# EAGLE design gyro_idg (EAGLE 6.1)
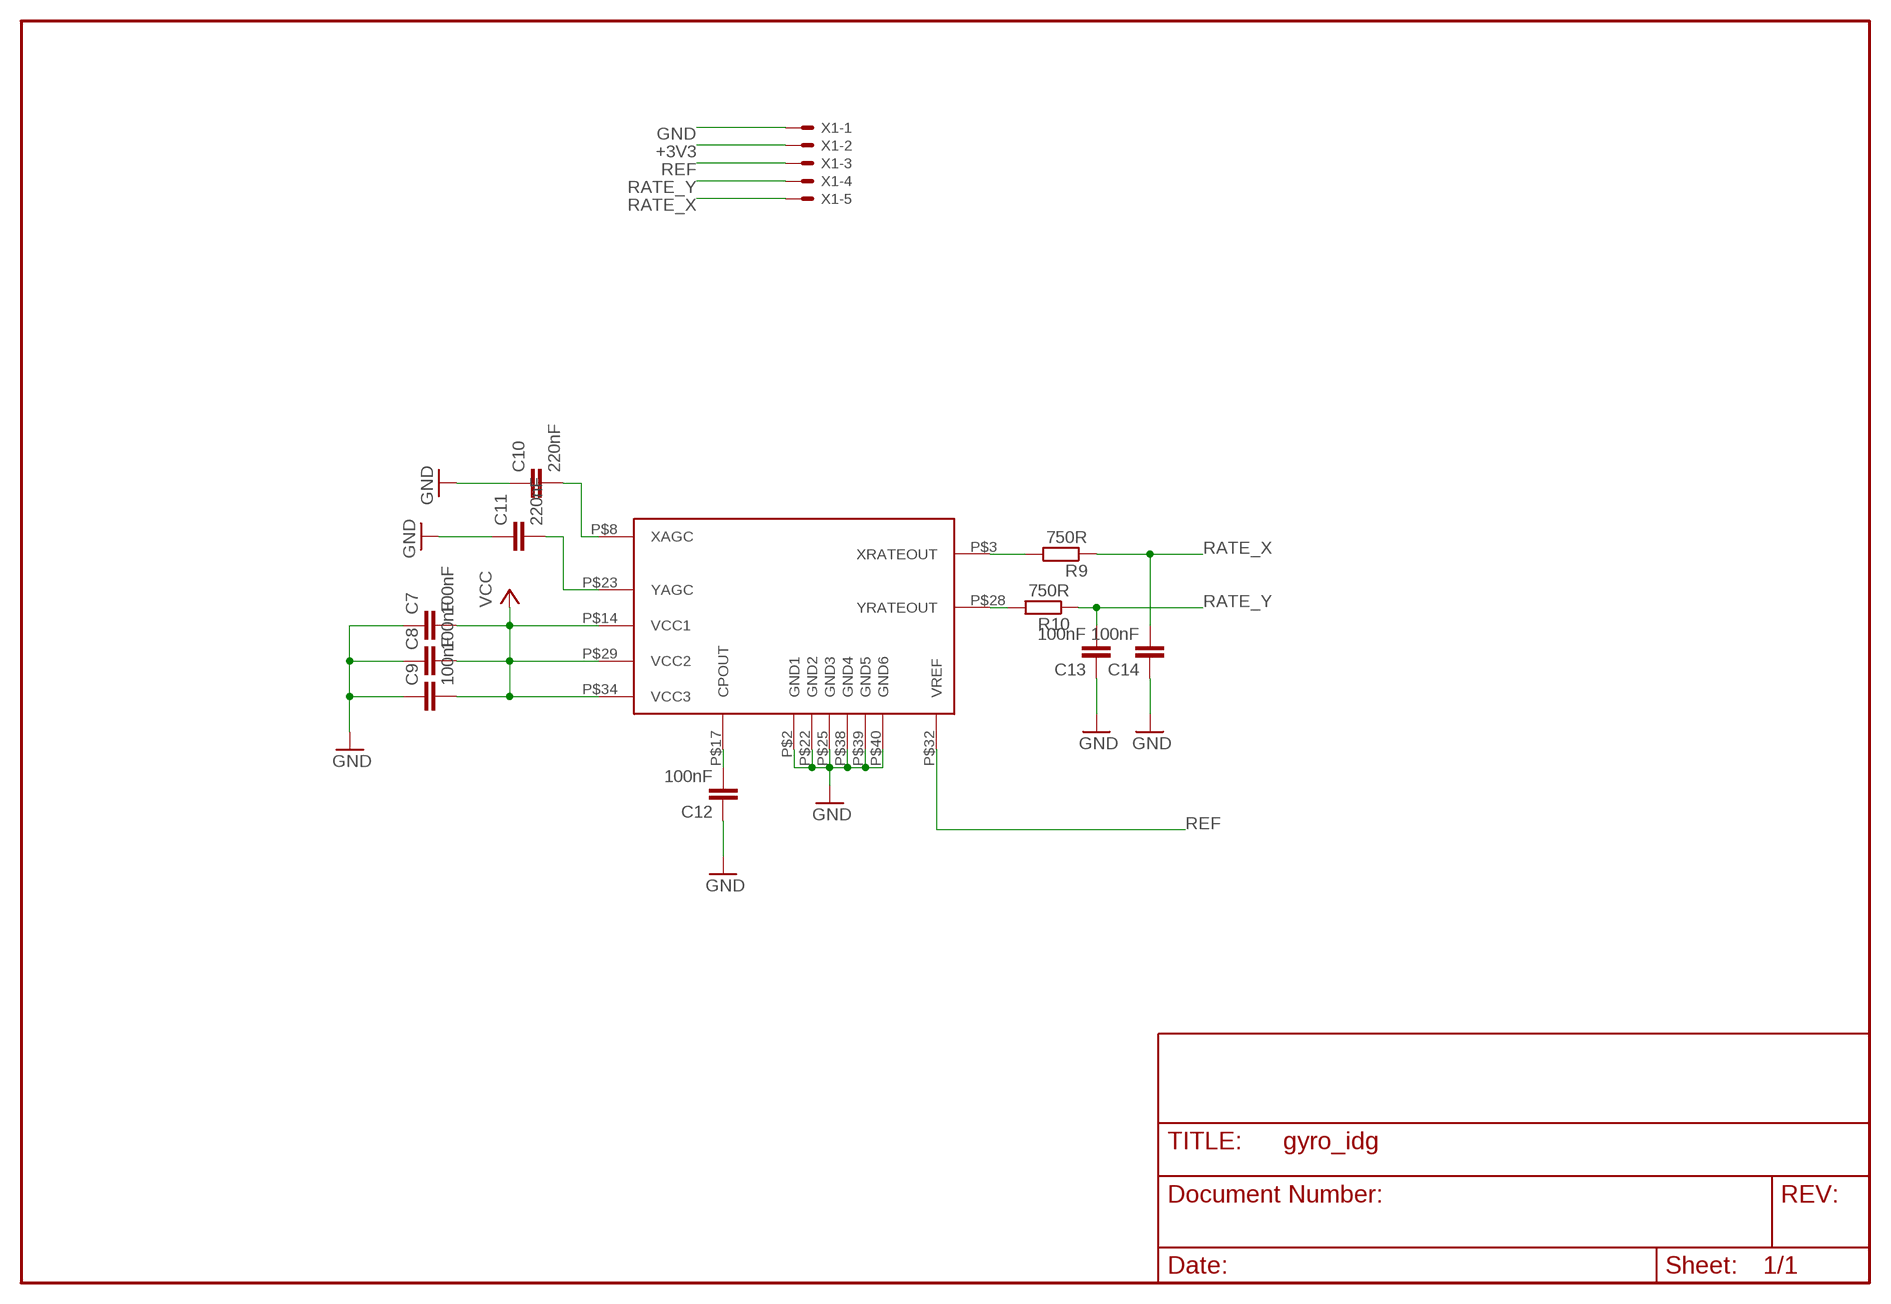
[diagram p0: schematic, sheet 1]

## Parts
C7  100nF  C-EUC0603K  [C0603K]
C8  100nF  C-EUC0603K  [C0603K]
C9  100nF  C-EUC0603K  [C0603K]
C10  220nF  C-EUC0603K  [C0603K]
C11  220nF  C-EUC0603K  [C0603K]
C12  100nF  C-EUC0603K  [C0603K]
C13  100nF  C-EUC0603K  [C0603K]
C14  100nF  C-EUC0603K  [C0603K]
R9  750R  R-EU_R0603  [R0603]
R10  750R  R-EU_R0603  [R0603]
U$2  IDG300  [IDG300]
X1  53047-05  [53047-05]

## Nets
+3V3: C7.2 C8.2 C9.2 U$2.P$14(VCC1) U$2.P$29(VCC2) U$2.P$34(VCC3) X1.2 ; supply symbol labelled VCC
GND: C7.1 C8.1 C9.1 C10.1 C11.1 C12.1 C13.1 C14.1 U$2.P$2(GND1) U$2.P$22(GND2) U$2.P$25(GND3) U$2.P$38(GND4) U$2.P$39(GND5) U$2.P$40(GND6) X1.1
N$5: C11.2 U$2.P$23(YAGC)
N$9: C10.2 U$2.P$8(XAGC)
N$10: R9.2 U$2.P$3(XRATEOUT)
N$12: R10.2 U$2.P$28(YRATEOUT)
N$15: C12.2 U$2.P$17(CPOUT)
RATE_X: C14.2 R9.1 X1.5
RATE_Y: C13.2 R10.1 X1.4
REF: U$2.P$32(VREF) X1.3

## Library data of the parts
C7-C14 = rcl:C-EU: CAPACITOR, European symbol
R9 R10 = rcl:R-EU_: RESISTOR, European symbol
U$2 = paparazzi:IDG300
X1 = con-molex:53?-05: CONNECTOR wire to board 1.25 mm (.049 inch) pitch header

## Board
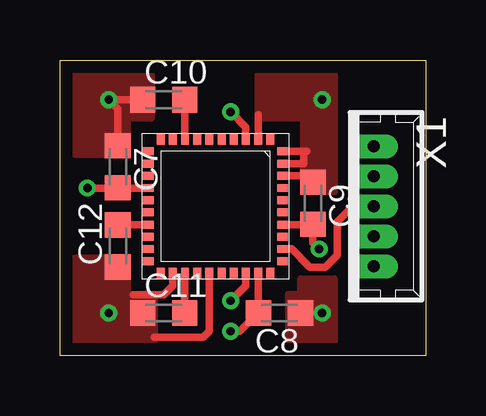
[diagram p1: board, top side]
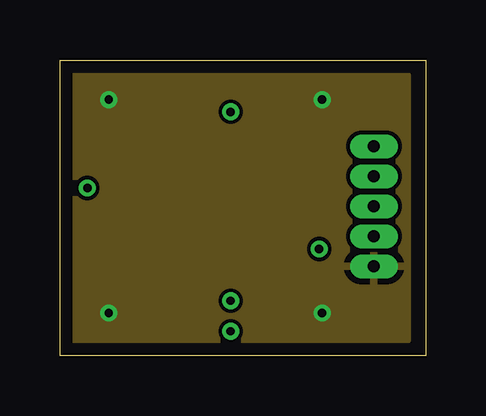
[diagram p2: board, inner layer Route2]
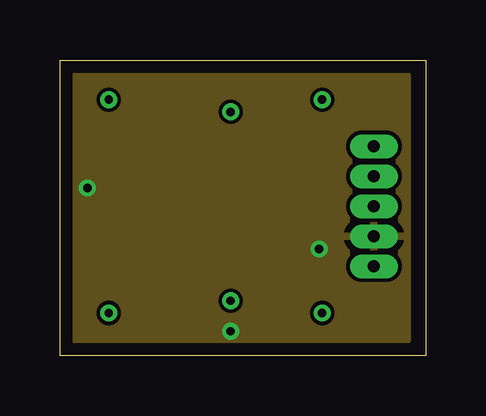
[diagram p3: board, inner layer Route15]
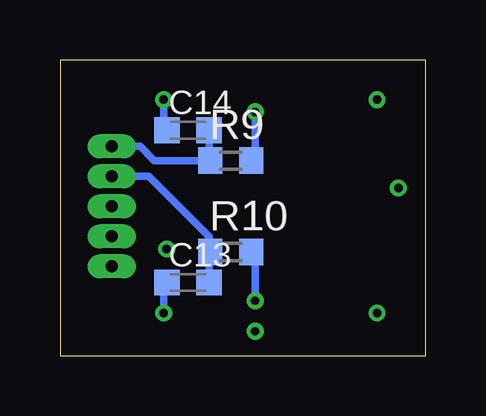
[diagram p4: board, bottom side, seen from below]

Size 15.24 x 12.32 mm. Coordinates in mm from the lower left corner, seen from the top.
Outline: 0,12.32 15.24,12.32 15.24,0 0,0 0,12.32
Copper layers (1*2+15*16): Top 0.035mm / dielectric 0.2mm / Route2 0.035mm / dielectric 1.5mm / Route15 0.035mm / dielectric 0.2mm / Bottom 0.035mm
Design rules: minimum track width 0.15mm, minimum drill 0.35mm, track to track 0.15mm, track to pad 0.15mm, pad to pad 0.15mm, via to via 0.15mm, smd to smd 0.15mm, copper to edge 20mil, drill to drill 8mil, minimum pad ring 10mil, minimum via ring 7mil, stop-mask expansion 4mil, vias tented up to drill 0mil, thermal gap 10mil

### Footprints (pad centres in the part's own frame; a part is rotated, then mirrored left to right if it is on the bottom)
C0603K = smd 1.05 x 1.08: 1 -0.875,0; 2 0.875,0
R0603 = smd 1 x 1.1: 1 -0.85,0; 2 0.85,0
IDG300 = smd 0.457 x 0.33: P$1 -2.794,2.286; P$2 -2.794,1.778; P$3 -2.794,1.27; P$4 -2.794,0.762; P$5 -2.794,0.254; P$6 -2.794,-0.254; P$7 -2.794,-0.762; P$8 -2.794,-1.27; P$9 -2.794,-1.778; P$10 -2.794,-2.286; P$21 2.794,-2.286; P$22 2.794,-1.778; P$23 2.794,-1.27; P$24 2.794,-0.762; P$25 2.794,-0.254; P$26 2.794,0.254; P$27 2.794,0.762; P$28 2.794,1.27; P$29 2.794,1.778; P$30 2.794,2.286 | smd 0.33 x 0.457: P$11 -2.286,-2.794; P$12 -1.778,-2.794; P$13 -1.27,-2.794; P$14 -0.762,-2.794; P$15 -0.254,-2.794; P$16 0.254,-2.794; P$17 0.762,-2.794; P$18 1.27,-2.794; P$19 1.778,-2.794; P$20 2.286,-2.794; P$31 2.286,2.794; P$32 1.778,2.794; P$33 1.27,2.794; P$34 0.762,2.794; P$35 0.254,2.794; P$36 -0.254,2.794; P$37 -0.762,2.794; P$38 -1.27,2.794; P$39 -1.778,2.794; P$40 -2.286,2.794
53047-05 = drill 0.5 pad 0.698 long: 1 2.5,0; 2 1.25,0; 3 0,0; 4 -1.25,0; 5 -2.5,0

### Placement (x,y rotation side)
C7  2.41,7.87 270 top
C8  9.14,1.78 180 top
C9  10.54,6.35 270 top
C10  4.32,10.67 0 top
C11  4.32,1.78 0 top
C12  2.41,4.57 90 top
C13  9.91,3.05 0 bottom
C14  9.91,9.4 0 bottom
R9  8.13,8.13 0 bottom
R10  8.13,4.32 0 bottom
U$2  6.48,6.22 270 top
X1  13.08,6.22 270 top

### Tracks (layer width: path | path; a pad name or v marks a point on that pad's centre or on a via)
+3V3  (via drill 0.35)
  Top 0.305: U$2.P$34 10.54,5.46 | 2.41,6.99 U$2.P$14 | 2.41,6.99 C7.2 | v1.14,6.99 2.41,6.99 | 8.25,1.78 U$2.P$29 | 8.25,1.78 C8.2 | v7.11,1.02 7.49,1.02 8.25,1.78 | 10.54,5.46 C9.2 | v10.79,4.45 10.54,4.7 10.54,5.46
  pour Route15: 14.48,11.68 0.64,11.68 0.64,0.64 14.48,0.64
GND  (via drill 0.35)
  Top 0.305: C10.1 v2.03,10.67 2.41,10.29 C7.1 | U$2.P$22 4.7,2.92 4.32,2.54 3.05,2.54 | U$2.P$2 8.25,10.03 | U$2.P$40 10.16,8.51 | 10.16,8.51 10.29,8.51 | 10.16,8.51 10.16,8 U$2.P$39 | C9.1 10.54,7.49 U$2.P$38 | U$2.P$25 6.22,1.02 5.97,0.76 3.94,0.76
  Bottom 0.305: C14.1 10.92,9.54 v10.92,10.67 | C13.1 10.79,3.05 10.92,2.92 v10.92,1.78
  other vias: 2.03,1.78
  pour Route2: 14.48,11.68 0.64,11.68 0.64,0.64 14.48,0.64
  pour Top (no thermals): 0.64,4.06 2.79,4.06 2.79,2.54 3.94,2.54 3.94,0.64 0.64,0.64
  pour Top (no thermals): 3.81,11.68 0.64,11.68 0.64,8.38 2.79,8.38 2.79,9.91 3.81,9.91
  pour Top (no thermals): 8.25,9.91 8.25,11.68 11.43,11.68 11.43,6.86 10.16,6.86 10.16,9.91
  pour Top (no thermals): 10.03,3.17 11.43,3.17 11.43,0.64 9.52,0.64 9.52,2.54 10.03,2.54
N$5
  Top 0.305: C11.2 5.21,1.78 U$2.P$23
N$9
  Top 0.305: C10.2 5.21,10.67 U$2.P$8
N$10  (via drill 0.35)
  Top 0.305: U$2.P$3 7.75,9.52 v7.11,10.16
  Bottom 0.305: R9.2 7.24,8.13 7.11,8.25 v7.11,10.16
N$12  (via drill 0.35)
  Top 0.305: U$2.P$28 7.75,2.92 v7.11,2.29
  Bottom 0.305: R10.2 7.37,4.32 7.11,4.06 v7.11,2.29
N$15
  Top 0.305: C12.2 2.41,5.46 U$2.P$17
RATE_X
  Bottom 0.305: X1.5 11.9,8.72 11.3,8.13 9.02,8.13 | 9.02,8.13 R9.1 | C14.2 9.03,8.14 9.02,8.13
RATE_Y
  Bottom 0.305: C13.2 9.03,4.3 9.02,4.32 R10.1 8.98,4.41 9.02,4.45 9.02,4.95 11.54,7.47 X1.4
REF
  Top 0.305: X1.3 12.19,6.22 11.56,5.59 11.56,4.19 11.05,3.68 10.41,3.68 9.65,4.45 U$2.P$32

### Text on the board
tDocu: X | Y | o